# Altium schematic sheet Main.SchDoc
size A; SheetNumber: 1; SheetTotal: 1
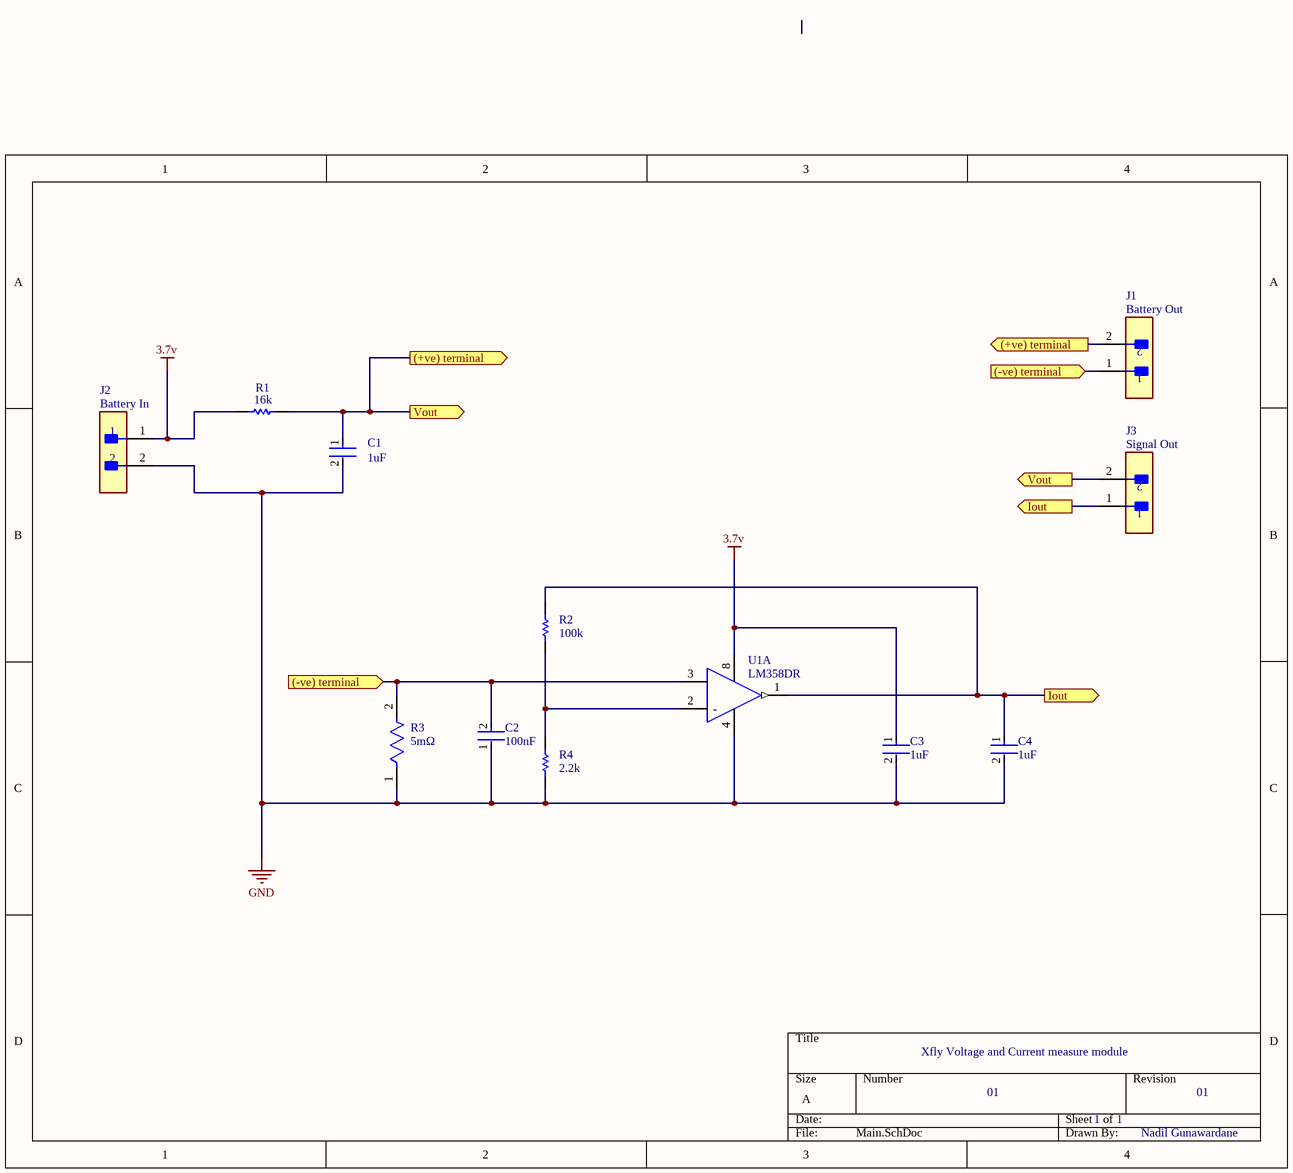
[diagram p0: Main.SchDoc]

## Parts
C1  Capacitance: 1uF  [FP-CL21-IPC_B]  (hidden comment: CL21F105ZAFNNNF)
C2  Capacitance: 100nF  [FP-GCJ188-0_2-MFG]  (hidden comment: GCJ188R71H104KA12D)
C3  Capacitance: 1uF  [FP-CL21-IPC_B]  (hidden comment: CL21F105ZAFNNNF)
C4  Capacitance: 1uF  [FP-CL21-IPC_B]  (hidden comment: CL21F105ZAFNNNF)
J1  Battery Out  [FP-26-48-1025-MFG]
J2  Battery In  [FP-26-48-1025-MFG]
J3  Signal Out  [FP-26-48-1025-MFG]
R1  value 16k  [RESC1608X55X30ML15T15]  (hidden comment: ERJ-3EKF1602V)
R2  value 100k  [RESC1005X37X25ML05T10]  (hidden comment: RE0402DR-07100KL)
R3  value 5mΩ  [FP-PA2512E-0R005-0R006-MFG]  (hidden comment: PA2512FKE7W0R005E)
R4  value 2.2k  [RESC1609X50X30LL10T20]  (hidden comment: CRCW06032K20JNEA)
U1  LM358DR  [FP-D0008A-MFG]  (part A of 2)

## Ports
(+ve) terminal (out, see Main[2A]), (+ve) terminal (out, see Main[4A]), (-ve) terminal (in, see Main[1C]), (-ve) terminal (in, see Main[4A]), Iout (out, see Main[4B]), Iout (out, see Main[4C]), Vout (out, see Main[2B]), Vout (out, see Main[4B])

## Nets
3.7v: C3.1 J2.1 R1.1 U1.8(V+)
GND: C1.2 C2.1 C3.2 C4.2 J2.2 R3.1 R4.1 U1.4(V-)
(+ve) terminal: C1.1 J1.2 J3.2 R1.2 ; port Vout, port (+ve) terminal
(-ve) terminal: C2.2 J1.1 R3.2 U1.3(IN1+) ; port (-ve) terminal
Iout: C4.1 J3.1 R2.2 U1.1(1OUT) ; port Iout
NetR2_1: R2.1 R4.2 U1.2(IN1-)

## Notes on the sheet
- Xfly Voltage and Current measure module
- 01
- 1
- Nadil Gunawardane
- (in symbol CMP-1685-00009-2, part A) -

## Library data of the parts
C1 C3 C4 = CMP-13271-002018-1: CL21 Series 0805 1uF 25V -20/+80% Tolerance Y5V Multilayer Ceramic Chip Capacitor; Tolerance: 80%; Voltage Rating: 25V; Voltage Rating (DC): 25V; Thickness: 0.053inch; Radiation Hardening: No; Width: 0.049inch; Height: 1.25mm; Max Operating Temperature: 85°C; Mount: Surface Mount; Package Quantity: 10000; Depth: 1.25mm; Min Operating Temperature: -30°C; Packaging: Tape and Reel; Case/Package: 0805; Length: 2mm; Dielectric: Y5V
C2 = CMP-2006-02223-2: Cap Ceramic 0.1uF 50V X7R 10% Pad SMD 0603 Soft Termination +125°C Automotive T/R; Radiation Hardening: No; Dielectric: X7R; Voltage Rating (DC): 50V; Case Code (Imperial): 0603; Length: 1.6mm; Features: Soft Termination; Case Code (Metric): 1608; Case/Package: 0603; Termination: SMD/SMT; Packaging: Tape and Reel; Height: 0.8mm; Tolerance: 10%; Thickness: 0.035inch; Width: 0.031inch; Voltage Rating: 50V; Min Operating Temperature: -55°C; Ratings: AEC-Q200; Package Quantity: 1; Depth: 0.8mm; Mount: Surface Mount; Lead Free: Lead Free; Max Operating Temperature: 125°C
J1-J3 = CMP-04776-000772-1: CONN HEADER VERT 2POS 3.96MM; Max Current Rating: 6A; Number of Contacts: 2; Approvals: UL; Voltage Rating (AC): 250V; Gender: Male; Contact Resistance: 10mR; Connector Type: Male Pin; Current Rating: 7A; Packaging: Bulk; Fastening Type: Friction; Flammability Rating: UL94 V-0; Contact Type: Male Pin; Termination: Solder; Pitch: 3.96mm; Radiation Hardening: No; Number of Rows: 1; Contact Material: Brass; RoHS Compliant: Yes; Contact Plating: Tin; Depth: 9.02mm; Package Quantity: 100; Housing Color: Black; Series: KK® 41671; Color: Black; Number of Positions: 2; Length: 7.87mm; Contact Mating Length: 0.45inch; Max Operating Temperature: 75°C; Min Operating Temperature: 0°C; Mount: Through Hole; Voltage Rating: 250V; Orientation: Straight; Housing Material: Polyester; Height: 12.8mm; Lead Pitch: 3.96mm
R1 = CMP-2000-00271-1: Manufacturer: Panasonic; Part Number: ERJ-3EKF1602V
R2 = CMP-2002-01850-1: Manufacturer: Yageo / Phycomp; Part Number: RE0402DR-07100KL
R3 = CMP-03412-003035-1: METAL CURRENT SENSOR 2512 1% 50P; Manufacturer: Yageo; Automotive Grade: Grade 0; Temperature Coefficient: 50ppm/°C; Power Rating: 2W; Description: 5 mOhms ±1% 2W Chip Resistor 2512 (6432 Metric) Automotive AEC-Q200, Current Sense, Moisture Resistant Metal Element; Package: PA2512E-0R005-0R006; Digikey Description: METAL CURRENT SENSOR 2512 1% 50P; Device Class L1: Passive Components; Temperature Range High: +170°C; ComponentLink2Description: Datasheet; Device Class L2: Resistors; Composition: Metal Element; Temperature Range Low: -55°C; Lead Free: Yes; Tolerance: 1%; Manufacturer Part Number: PA2512FKE7W0R005E; Category: Res; Device Class L3: Chip SMD Resistors; Height: 0.88mm; Automotive: Yes; Temperature: -55°C to +170°C; Resistance: 5mΩ; Octopart: https://octopart.com/pa2512fke7w0r005e-yageo-96322222; Series: PA_E; RoHS: TRUE; Ipc Land Pattern Name: RESC635318X63; ComponentLink2URL: http://www.yageo.com/NewPortal/yageodocoutput?fileName=/pdf/R-Chip/PYu-PA_E_51_RoHS_10.pdf
R4 = CMP-2000-03169-1: Manufacturer: Vishay Dale; Part Number: CRCW06032K20JNEA
U1 = CMP-1685-00009-2: IC OPAMP GP 2 CIRCUIT 8SOIC; Output Current: 30mA; Min Dual Supply Voltage: 1.5V; Input Offset Voltage (Vos): 7mV; Power Supply Rejection Ratio (PSRR): 65dB; Unity Gain Bandwidth Product: 700kHz; Number of Channels: 2; Min Supply Voltage: 3V; Max Dual Supply Voltage: 16V; Dual Supply Voltage: 9V; Max Supply Voltage: 32V; Nominal Supply Current: 1.2mA; Slew Rate: 0.3V/µs; Input Bias Current: 250nA; Voltage Gain: 100dB; Operating Supply Current: 1mA; REACH SVHC: No SVHC; Package Quantity: 2500; Width: 3.91mm; Max Operating Temperature: 70°C; Min Operating Temperature: 0°C; Mount: Surface Mount; Length: 4.9mm; Radiation Hardening: No; Case/Package: SOIC; Lead Free: Lead Free; Number of Elements: 2; Packaging: Tape and Reel; Output Current per Channel: 30mA; Number of Circuits: 2; Bandwidth: 700kHz; Operating Supply Voltage: 16V; Gain Bandwidth Product: 700kHz; Number of Pins: 8; Number of Amplifiers: 2; Height: 1.58mm; Common Mode Rejection Ratio: 65dB; Contact Plating: Gold